# EAGLE design fmc-hpc-generic (EAGLE 8.3.2)
DESIGNER: JON NEWMAN; DESIGN_NAME: FMC HPC GENERIC; LICENSE: CC BY-NC-SA 4.0; REVISION: 1.0
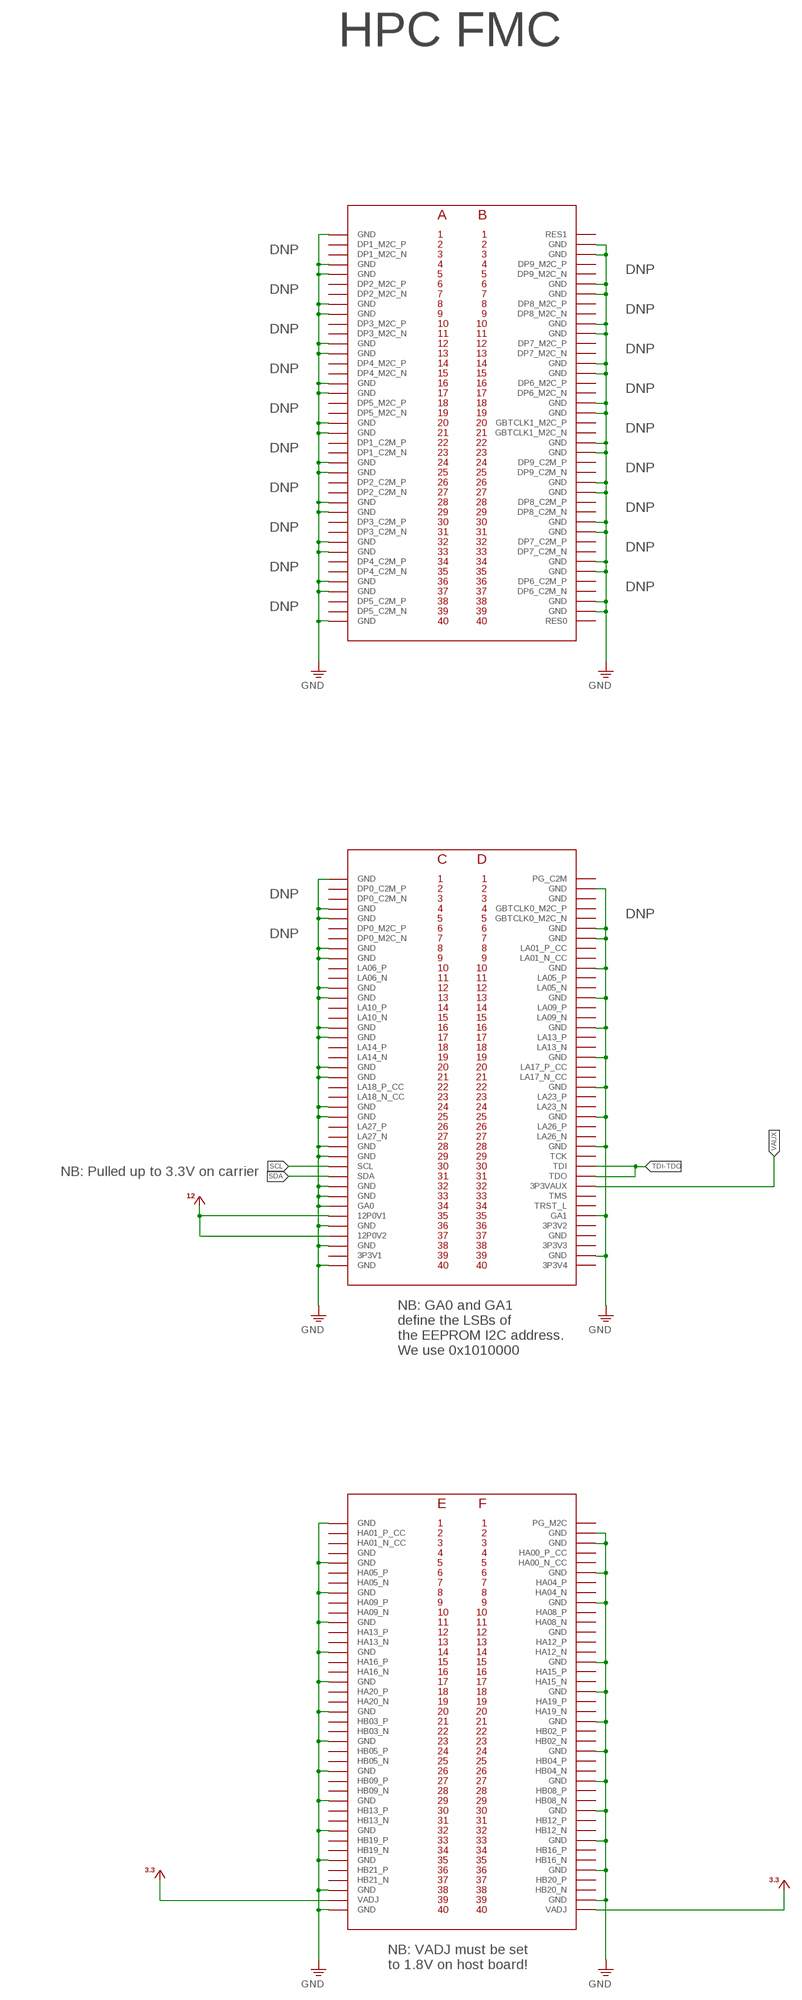
[diagram p0: schematic, sheet 1, part 1 of 3]
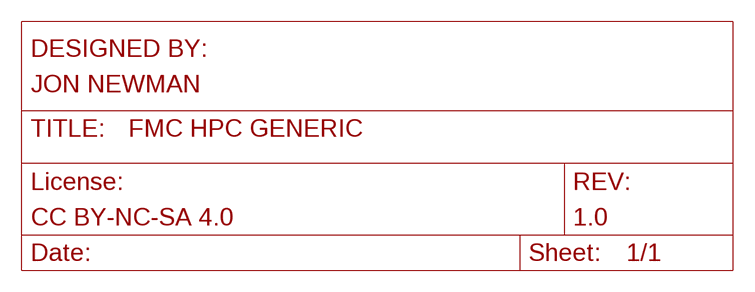
[diagram p1: schematic, sheet 1, part 2 of 3]
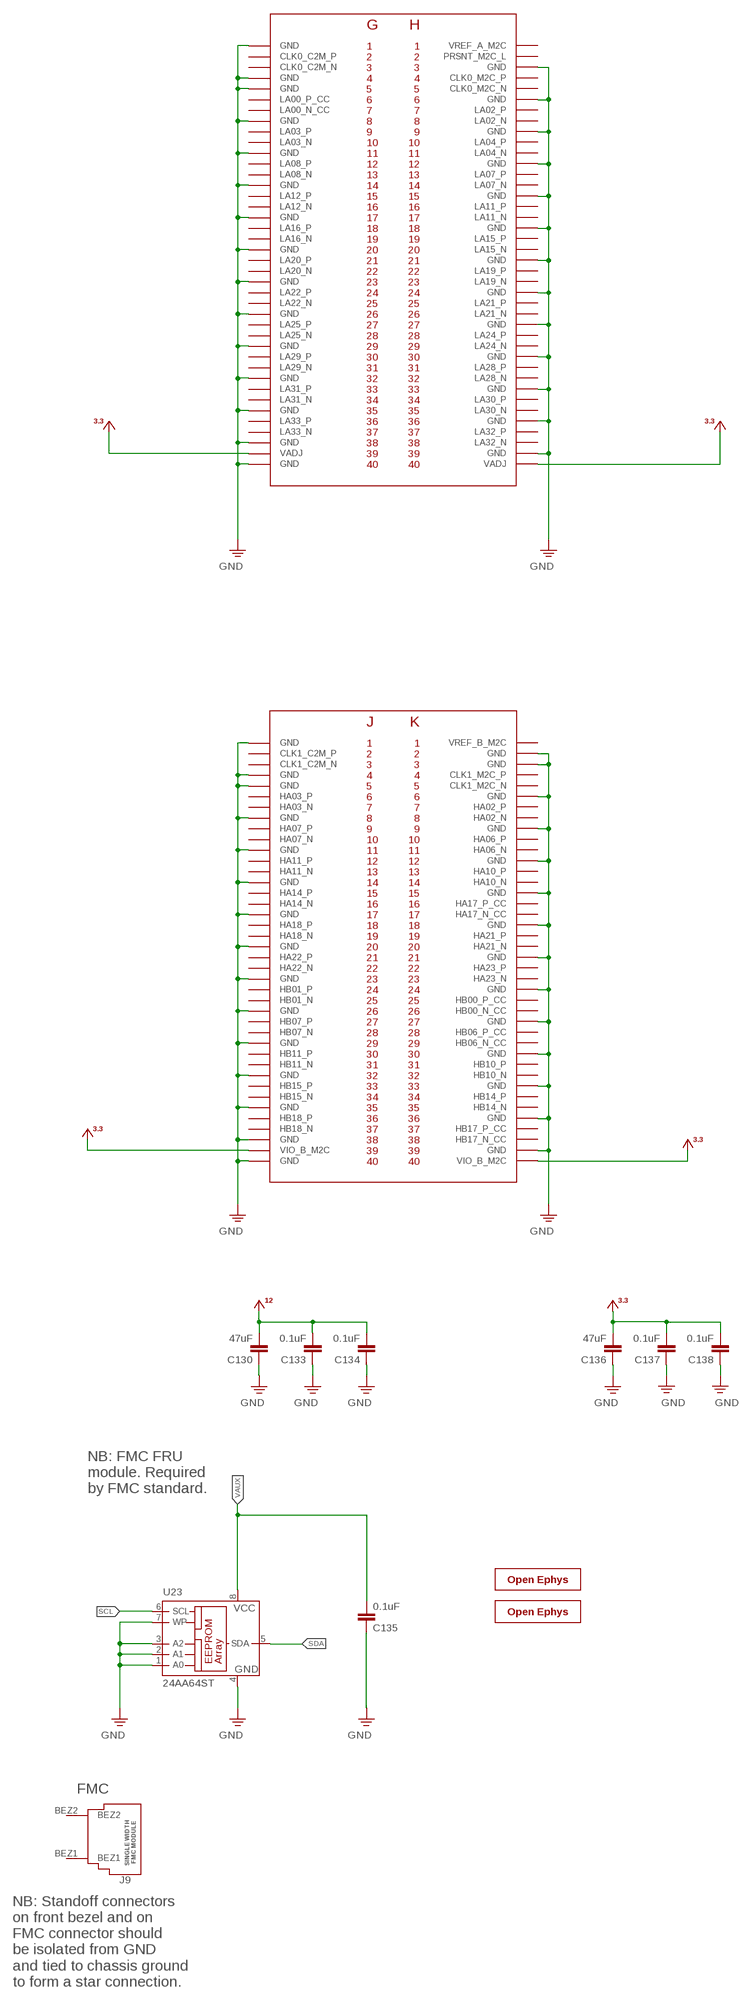
[diagram p2: schematic, sheet 1, part 3 of 3]

## Parts
C130  47uF  C_1210  [1210]
C133  0.1uF  C_0402  [0402]
C134  0.1uF  C_0402  [0402]
C135  0.1uF  C_0402  [0402]
C136  47uF  C_1210  [1210]
C137  0.1uF  C_0402  [0402]
C138  0.1uF  C_0402  [0402]
J9  FMC_SINGLE_WIDTH_MODULE  [FMC_SINGLE_WIDTH_MODULE]
J10  ASP-134488-01  FMC_HPC_400_PIN_MALE  [FMC_HPC_MALE]
U23  24AA64ST  [TSSOP8]
X2  OE-LOGO_7X5  [OE-LOGO-7X5]
X3  OE-LOGO_7X5  [OE-LOGO-7X5]

## Nets
+3V3: C136.2 C137.2 C138.2 J10.E39(VADJ) J10.F40(VADJ) J10.G39(VADJ) J10.H40(VADJ) J10.J39(VIO_B_M2C) J10.K40(VIO_B_M2C)
+12V: C130.2 C133.2 C134.2 J10.C35(12P0V1) J10.C37(12P0V2)
GND: C130.1 C133.1 C134.1 C135.1 C136.1 C137.1 C138.1 J10.A1(GND) J10.A4(GND) J10.A5(GND) J10.A8(GND) J10.A9(GND) J10.A12(GND) J10.A13(GND) J10.A16(GND) J10.A17(GND) J10.A20(GND) J10.A21(GND) J10.A24(GND) J10.A25(GND) J10.A28(GND) J10.A29(GND) J10.A32(GND) J10.A33(GND) J10.A36(GND) J10.A37(GND) J10.A40(GND) J10.B2(GND) J10.B3(GND) J10.B6(GND) J10.B7(GND) J10.B10(GND) J10.B11(GND) J10.B14(GND) J10.B15(GND) J10.B18(GND) J10.B19(GND) J10.B22(GND) J10.B23(GND) J10.B26(GND) J10.B27(GND) J10.B30(GND) J10.B31(GND) J10.B34(GND) J10.B35(GND) J10.B38(GND) J10.B39(GND) J10.C1(GND) J10.C4(GND) J10.C5(GND) J10.C8(GND) J10.C9(GND) J10.C12(GND) J10.C13(GND) J10.C16(GND) J10.C17(GND) J10.C20(GND) J10.C21(GND) J10.C24(GND) J10.C25(GND) J10.C28(GND) J10.C29(GND) J10.C32(GND) J10.C33(GND) J10.C34(GA0) J10.C36(GND) J10.C38(GND) J10.C40(GND) J10.D2(GND) J10.D6(GND) J10.D7(GND) J10.D10(GND) J10.D13(GND) J10.D16(GND) J10.D19(GND) J10.D22(GND) J10.D25(GND) J10.D28(GND) J10.D35(GA1) J10.D39(GND) J10.E1(GND) J10.E5(GND) J10.E8(GND) J10.E11(GND) J10.E14(GND) J10.E17(GND) J10.E20(GND) J10.E23(GND) J10.E26(GND) J10.E29(GND) J10.E32(GND) J10.E35(GND) J10.E38(GND) J10.E40(GND) J10.F2(GND) J10.F3(GND) J10.F6(GND) J10.F9(GND) J10.F15(GND) J10.F18(GND) J10.F21(GND) J10.F24(GND) J10.F27(GND) J10.F30(GND) J10.F33(GND) J10.F36(GND) J10.F39(GND) J10.G1(GND) J10.G4(GND) J10.G5(GND) J10.G8(GND) J10.G11(GND) J10.G14(GND) J10.G17(GND) J10.G20(GND) J10.G23(GND) J10.G26(GND) J10.G29(GND) J10.G32(GND) J10.G35(GND) J10.G38(GND) J10.G40(GND) J10.H3(GND) J10.H6(GND) J10.H9(GND) J10.H12(GND) J10.H15(GND) J10.H18(GND) J10.H21(GND) J10.H24(GND) J10.H27(GND) J10.H30(GND) J10.H33(GND) J10.H36(GND) J10.H39(GND) J10.J1(GND) J10.J4(GND) J10.J5(GND) J10.J8(GND) J10.J11(GND) J10.J14(GND) J10.J17(GND) J10.J20(GND) J10.J23(GND) J10.J26(GND) J10.J29(GND) J10.J32(GND) J10.J35(GND) J10.J38(GND) J10.J40(GND) J10.K2(GND) J10.K3(GND) J10.K6(GND) J10.K9(GND) J10.K12(GND) J10.K15(GND) J10.K18(GND) J10.K21(GND) J10.K24(GND) J10.K27(GND) J10.K30(GND) J10.K33(GND) J10.K36(GND) J10.K39(GND) U23.1(A0) U23.2(A1) U23.3(A2) U23.4(GND) U23.7(WP)
SCL: J10.C30(SCL) U23.6(SCL)
SDA: J10.C31(SDA) U23.5(SDA)
TDI-TDO: J10.D30(TDI) J10.D31(TDO)
VAUX: C135.2 J10.D32(3P3VAUX) U23.8(VCC)
Unconnected: J9.BEZ1 J9.BEZ2 J10.A2(DP1_M2C_P) J10.A3(DP1_M2C_N) J10.A6(DP2_M2C_P) J10.A7(DP2_M2C_N) J10.A10(DP3_M2C_P) J10.A11(DP3_M2C_N) J10.A14(DP4_M2C_P) J10.A15(DP4_M2C_N) J10.A18(DP5_M2C_P) J10.A19(DP5_M2C_N) J10.A22(DP1_C2M_P) J10.A23(DP1_C2M_N) J10.A26(DP2_C2M_P) J10.A27(DP2_C2M_N) J10.A30(DP3_C2M_P) J10.A31(DP3_C2M_N) J10.A34(DP4_C2M_P) J10.A35(DP4_C2M_N) J10.A38(DP5_C2M_P) J10.A39(DP5_C2M_N) J10.B1(RES1) J10.B4(DP9_M2C_P) J10.B5(DP9_M2C_N) J10.B8(DP8_M2C_P) J10.B9(DP8_M2C_N) J10.B12(DP7_M2C_P) J10.B13(DP7_M2C_N) J10.B16(DP6_M2C_P) J10.B17(DP6_M2C_N) J10.B20(GBTCLK1_M2C_P) J10.B21(GBTCLK1_M2C_N) J10.B24(DP9_C2M_P) J10.B25(DP9_C2M_N) J10.B28(DP8_C2M_P) J10.B29(DP8_C2M_N) J10.B32(DP7_C2M_P) J10.B33(DP7_C2M_N) J10.B36(DP6_C2M_P) J10.B37(DP6_C2M_N) J10.B40(RES0) J10.C2(DP0_C2M_P) J10.C3(DP0_C2M_N) J10.C6(DP0_M2C_P) J10.C7(DP0_M2C_N) J10.C10(LA06_P) J10.C11(LA06_N) J10.C14(LA10_P) J10.C15(LA10_N) J10.C18(LA14_P) J10.C19(LA14_N) J10.C22(LA18_P_CC) J10.C23(LA18_N_CC) J10.C26(LA27_P) J10.C27(LA27_N) J10.C39(3P3V1) J10.D1(PG_C2M) J10.D4(GBTCLK0_M2C_P) J10.D5(GBTCLK0_M2C_N) J10.D8(LA01_P_CC) J10.D9(LA01_N_CC) J10.D11(LA05_P) J10.D12(LA05_N) J10.D14(LA09_P) J10.D15(LA09_N) J10.D17(LA13_P) J10.D18(LA13_N) J10.D20(LA17_P_CC) J10.D21(LA17_N_CC) J10.D23(LA23_P) J10.D24(LA23_N) J10.D26(LA26_P) J10.D27(LA26_N) J10.D29(TCK) J10.D33(TMS) J10.D34(TRST_L) J10.D36(3P3V2) J10.D38(3P3V3) J10.D40(3P3V4) J10.E2(HA01_P_CC) J10.E3(HA01_N_CC) J10.E6(HA05_P) J10.E7(HA05_N) J10.E9(HA09_P) J10.E10(HA09_N) J10.E12(HA13_P) J10.E13(HA13_N) J10.E15(HA16_P) J10.E16(HA16_N) J10.E18(HA20_P) J10.E19(HA20_N) J10.E21(HB03_P) J10.E22(HB03_N) J10.E24(HB05_P) J10.E25(HB05_N) J10.E27(HB09_P) J10.E28(HB09_N) J10.E30(HB13_P) J10.E31(HB13_N) J10.E33(HB19_P) J10.E34(HB19_N) J10.E36(HB21_P) J10.E37(HB21_N) J10.F1(PG_M2C) J10.F4(HA00_P_CC) J10.F5(HA00_N_CC) J10.F7(HA04_P) J10.F8(HA04_N) J10.F10(HA08_P) J10.F11(HA08_N) J10.F13(HA12_P) J10.F14(HA12_N) J10.F16(HA15_P) J10.F17(HA15_N) J10.F19(HA19_P) J10.F20(HA19_N) J10.F22(HB02_P) J10.F23(HB02_N) J10.F25(HB04_P) J10.F26(HB04_N) J10.F28(HB08_P) J10.F29(HB08_N) J10.F31(HB12_P) J10.F32(HB12_N) J10.F34(HB16_P) J10.F35(HB16_N) J10.F37(HB20_P) J10.F38(HB20_N) J10.G2(CLK0_C2M_P) J10.G3(CLK0_C2M_N) J10.G6(LA00_P_CC) J10.G7(LA00_N_CC) J10.G9(LA03_P) J10.G10(LA03_N) J10.G12(LA08_P) J10.G13(LA08_N) J10.G15(LA12_P) J10.G16(LA12_N) J10.G18(LA16_P) J10.G19(LA16_N) J10.G21(LA20_P) J10.G22(LA20_N) J10.G24(LA22_P) J10.G25(LA22_N) J10.G27(LA25_P) J10.G28(LA25_N) J10.G30(LA29_P) J10.G31(LA29_N) J10.G33(LA31_P) J10.G34(LA31_N) J10.G36(LA33_P) J10.G37(LA33_N) J10.H1(VREF_A_M2C) J10.H2(PRSNT_M2C_L) J10.H4(CLK0_M2C_P) J10.H5(CLK0_M2C_N) J10.H7(LA02_P) J10.H8(LA02_N) J10.H10(LA04_P) J10.H11(LA04_N) J10.H13(LA07_P) J10.H14(LA07_N) J10.H16(LA11_P) J10.H17(LA11_N) J10.H19(LA15_P) J10.H20(LA15_N) J10.H22(LA19_P) J10.H23(LA19_N) J10.H25(LA21_P) J10.H26(LA21_N) J10.H28(LA24_P) J10.H29(LA24_N) J10.H31(LA28_P) J10.H32(LA28_N) J10.H34(LA30_P) J10.H35(LA30_N) J10.H37(LA32_P) J10.H38(LA32_N) J10.J2(CLK1_C2M_P) J10.J3(CLK1_C2M_N) J10.J6(HA03_P) J10.J7(HA03_N) J10.J9(HA07_P) J10.J10(HA07_N) J10.J12(HA11_P) J10.J13(HA11_N) J10.J15(HA14_P) J10.J16(HA14_N) J10.J18(HA18_P) J10.J19(HA18_N) J10.J21(HA22_P) J10.J22(HA22_N) J10.J24(HB01_P) J10.J25(HB01_N) J10.J27(HB07_P) J10.J28(HB07_N) J10.J30(HB11_P) J10.J31(HB11_N) J10.J33(HB15_P) J10.J34(HB15_N) J10.J36(HB18_P) J10.J37(HB18_N) J10.K1(VREF_B_M2C) J10.K4(CLK1_M2C_P) J10.K5(CLK1_M2C_N) J10.K7(HA02_P) J10.K8(HA02_N) J10.K10(HA06_P) J10.K11(HA06_N) J10.K13(HA10_P) J10.K14(HA10_N) J10.K16(HA17_P_CC) J10.K17(HA17_N_CC) J10.K19(HA21_P) J10.K20(HA21_N) J10.K22(HA23_P) J10.K23(HA23_N) J10.K25(HB00_P_CC) J10.K26(HB00_N_CC) J10.K28(HB06_P_CC) J10.K29(HB06_N_CC) J10.K31(HB10_P) J10.K32(HB10_N) J10.K34(HB14_P) J10.K35(HB14_N) J10.K37(HB17_P_CC) J10.K38(HB17_N_CC)

## Notes on the sheet
- HPC FMC
- DNP
- DNP
- DNP
- DNP
- DNP
- DNP
- DNP
- DNP
- DNP
- DNP
- DNP
- DNP
- DNP
- DNP
- DNP
- DNP
- DNP
- DNP
- DNP
- DNP
- DNP
- DNP
- NB: Pulled up to 3.3V on carrier
- NB: GA0 and GA1 
  define the LSBs of 
  the EEPROM I2C address.
  We use 0x1010000
- NB: VADJ must be set
  to 1.8V on host board!
- NB: FMC FRU 
  module. Required 
  by FMC standard.
- FMC
- NB: Standoff connectors
  on front bezel and on 
  FMC connector should
  be isolated from GND
  and tied to chassis ground
  to form a star connection.

## Power pins joined to a net without a drawn wire
GND: J10.D3(GND) J10.D37(GND) J10.E4(GND) J10.F12(GND)

## Library data of the parts
C130 C133-C138 = jonnew:C: Capacitor
J9 = jonnew:FMC_SINGLE_WIDTH_MODULE
J10 = jonnew:FMC_HPC_400_PIN
U23 = jonnew:24*: Serial EEPROM I2C; MPN: 25AA640A-I/ST; OC_FARNELL: 1818513; OC_NEWARK: 27M1300
X2 X3 = jonnew:OE-LOGO

## Net classes
1 130 Ohm Diff Top: width 0.09 mm, drill 0.2 mm, clearance 0.089 mm
2 50 Ohm Single Top: width 0.15 mm, drill 0.2 mm
3 100 Ohm Diff Mid: width 0.19 mm, drill 0.2 mm, clearance 0.09 mm
4 50 Ohm Single Mid: width 0.2 mm, drill 0.2 mm
5 100 Ohm Diff Top: width 0.15 mm, drill 0.2 mm, clearance 0.09 mm
6 Link: width 0.15 mm, drill 0.2 mm, clearance 0.5 mm
7 CAN 210 Diff Top: width 0.11 mm, drill 0.2 mm, clearance 0.09 mm

## Board
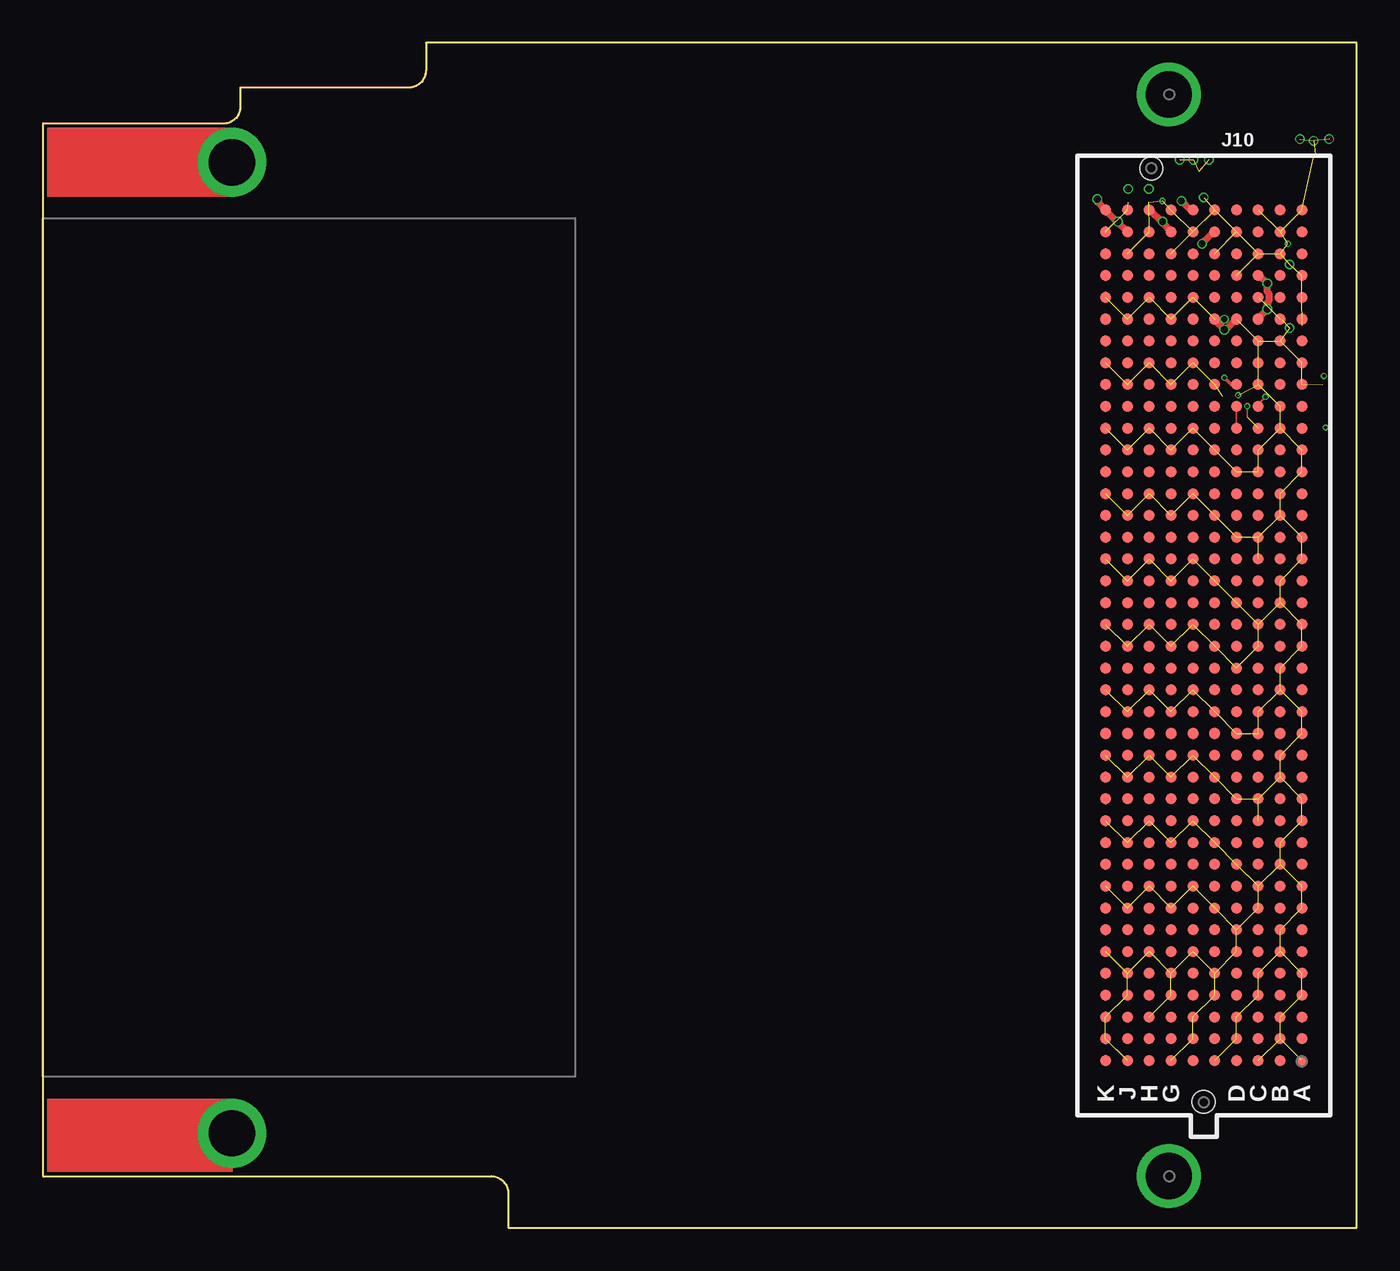
[diagram p3: board, top side]
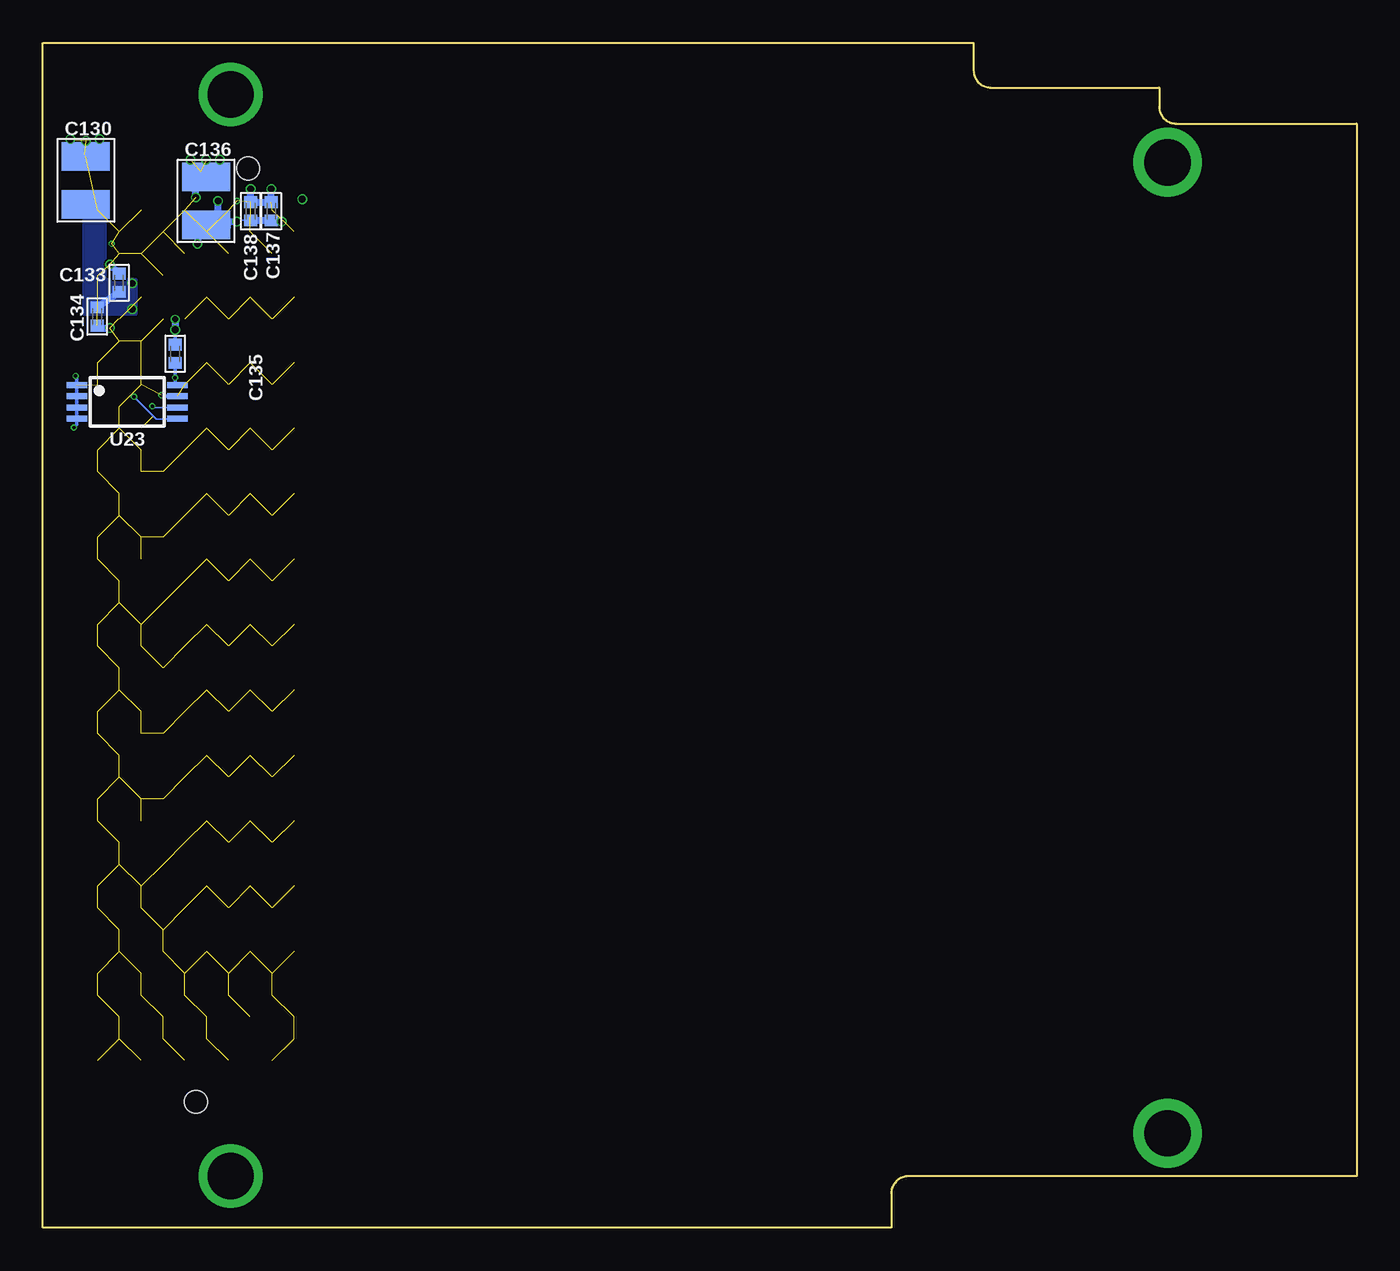
[diagram p4: board, bottom side, seen from below]

Size 76.5 x 69 mm. Coordinates in mm from the lower left corner, seen from the top.
Copper layers (1+2*3+4*5+16): Top/HighSpeed 0.035mm / dielectric 0.1mm / GND1 0.0175mm / dielectric 0.565mm / Highspeed2 0.0175mm / dielectric 5mil / GND3 0.0175mm / dielectric 0.565mm / VCC 0.0175mm / dielectric 0.1mm / Bottom/LowSpeed 0.035mm
Design rules "jlcpcb-6-layer *": minimum track width 3.5mil, minimum drill 0.2mm, track to track 3.5mil, track to pad 3.5mil, pad to pad 3.5mil, via to via 5mil, smd to smd 0mil, copper to edge 0.2mm, drill to drill 5mil, minimum pad ring 3mil, minimum via ring 3mil, stop-mask expansion 0mil, vias tented up to drill 100mil, thermal gap 0.12mm
tRestrict: area 63.6,1 to 67.6,5; area 63.6,64 to 67.6,68

### Footprints (pad centres in the part's own frame; a part is rotated, then mirrored left to right if it is on the bottom)
1210 = smd 1.651 x 2.794: 1 -1.397,0; 2 1.397,0
0402 = smd 0.686 x 0.762: 1 -0.533,0; 2 0.533,0
FMC_SINGLE_WIDTH_MODULE = drill 2.7 pad 4: BEZ1 -54.6,59.05; BEZ2 -54.6,2.5
FMC_HPC_MALE = smd 0.635 x 0.635: A1 24.765,5.715; A2 23.495,5.715; A3 22.225,5.715; A4 20.955,5.715; A5 19.685,5.715; A6 18.415,5.715; A7 17.145,5.715; A8 15.875,5.715; A9 14.605,5.715; A10 13.335,5.715; A11 12.065,5.715; A12 10.795,5.715; A13 9.525,5.715; A14 8.255,5.715; A15 6.985,5.715; A16 5.715,5.715; A17 4.445,5.715; A18 3.175,5.715; A19 1.905,5.715; A20 0.635,5.715; A21 -0.635,5.715; A22 -1.905,5.715; A23 -3.175,5.715; A24 -4.445,5.715; A25 -5.715,5.715; A26 -6.985,5.715; A27 -8.255,5.715; A28 -9.525,5.715; A29 -10.795,5.715; A30 -12.065,5.715; A31 -13.335,5.715; A32 -14.605,5.715; A33 -15.875,5.715; A34 -17.145,5.715; A35 -18.415,5.715; A36 -19.685,5.715; A37 -20.955,5.715; A38 -22.225,5.715; A39 -23.495,5.715; A40 -24.765,5.715; B1 24.765,4.445; B2 23.495,4.445; B3 22.225,4.445; B4 20.955,4.445; B5 19.685,4.445; B6 18.415,4.445; B7 17.145,4.445; B8 15.875,4.445; B9 14.605,4.445; B10 13.335,4.445; B11 12.065,4.445; B12 10.795,4.445; B13 9.525,4.445; B14 8.255,4.445; B15 6.985,4.445; B16 5.715,4.445; B17 4.445,4.445; B18 3.175,4.445; B19 1.905,4.445; B20 0.635,4.445; B21 -0.635,4.445; B22 -1.905,4.445; B23 -3.175,4.445; B24 -4.445,4.445; B25 -5.715,4.445; B26 -6.985,4.445; B27 -8.255,4.445; B28 -9.525,4.445; B29 -10.795,4.445; B30 -12.065,4.445; B31 -13.335,4.445; B32 -14.605,4.445; B33 -15.875,4.445; B34 -17.145,4.445; B35 -18.415,4.445; B36 -19.685,4.445; B37 -20.955,4.445; B38 -22.225,4.445; B39 -23.495,4.445; B40 -24.765,4.445; C1 24.765,3.175; C2 23.495,3.175; C3 22.225,3.175; C4 20.955,3.175; C5 19.685,3.175; C6 18.415,3.175; C7 17.145,3.175; C8 15.875,3.175; C9 14.605,3.175; C10 13.335,3.175; C11 12.065,3.175; C12 10.795,3.175; C13 9.525,3.175; C14 8.255,3.175; C15 6.985,3.175; C16 5.715,3.175; C17 4.445,3.175; C18 3.175,3.175; C19 1.905,3.175; C20 0.635,3.175; C21 -0.635,3.175; C22 -1.905,3.175; C23 -3.175,3.175; C24 -4.445,3.175; C25 -5.715,3.175; C26 -6.985,3.175; C27 -8.255,3.175; C28 -9.525,3.175; C29 -10.795,3.175; C30 -12.065,3.175; C31 -13.335,3.175; C32 -14.605,3.175; C33 -15.875,3.175; C34 -17.145,3.175; C35 -18.415,3.175; C36 -19.685,3.175; C37 -20.955,3.175; C38 -22.225,3.175; C39 -23.495,3.175; C40 -24.765,3.175; D1 24.765,1.905; D2 23.495,1.905; D3 22.225,1.905; D4 20.955,1.905; D5 19.685,1.905; D6 18.415,1.905; D7 17.145,1.905; D8 15.875,1.905; D9 14.605,1.905; D10 13.335,1.905; D11 12.065,1.905; D12 10.795,1.905; D13 9.525,1.905; D14 8.255,1.905; D15 6.985,1.905; D16 5.715,1.905; D17 4.445,1.905; D18 3.175,1.905; D19 1.905,1.905; D20 0.635,1.905; D21 -0.635,1.905; D22 -1.905,1.905; D23 -3.175,1.905; D24 -4.445,1.905; D25 -5.715,1.905; D26 -6.985,1.905; D27 -8.255,1.905; D28 -9.525,1.905; D29 -10.795,1.905; D30 -12.065,1.905; D31 -13.335,1.905; D32 -14.605,1.905; D33 -15.875,1.905; D34 -17.145,1.905; D35 -18.415,1.905; D36 -19.685,1.905; D37 -20.955,1.905; D38 -22.225,1.905; D39 -23.495,1.905; D40 -24.765,1.905; E1 24.765,0.635; E2 23.495,0.635; E3 22.225,0.635; E4 20.955,0.635; E5 19.685,0.635; E6 18.415,0.635; E7 17.145,0.635; E8 15.875,0.635; E9 14.605,0.635; E10 13.335,0.635; E11 12.065,0.635; E12 10.795,0.635; E13 9.525,0.635; E14 8.255,0.635; E15 6.985,0.635; E16 5.715,0.635; E17 4.445,0.635; E18 3.175,0.635; E19 1.905,0.635; E20 0.635,0.635; E21 -0.635,0.635; E22 -1.905,0.635; E23 -3.175,0.635; E24 -4.445,0.635; E25 -5.715,0.635; E26 -6.985,0.635; E27 -8.255,0.635; E28 -9.525,0.635; E29 -10.795,0.635; E30 -12.065,0.635; E31 -13.335,0.635; E32 -14.605,0.635; E33 -15.875,0.635; E34 -17.145,0.635; E35 -18.415,0.635; E36 -19.685,0.635; E37 -20.955,0.635; E38 -22.225,0.635; E39 -23.495,0.635; E40 -24.765,0.635; F1 24.765,-0.635; F2 23.495,-0.635; F3 22.225,-0.635; F4 20.955,-0.635; F5 19.685,-0.635; F6 18.415,-0.635; F7 17.145,-0.635; F8 15.875,-0.635; F9 14.605,-0.635; F10 13.335,-0.635; F11 12.065,-0.635; F12 10.795,-0.635; F13 9.525,-0.635; F14 8.255,-0.635; F15 6.985,-0.635; F16 5.715,-0.635; F17 4.445,-0.635; F18 3.175,-0.635; F19 1.905,-0.635; F20 0.635,-0.635; F21 -0.635,-0.635; F22 -1.905,-0.635; F23 -3.175,-0.635; F24 -4.445,-0.635; F25 -5.715,-0.635; F26 -6.985,-0.635; F27 -8.255,-0.635; F28 -9.525,-0.635; F29 -10.795,-0.635; F30 -12.065,-0.635; F31 -13.335,-0.635; F32 -14.605,-0.635; F33 -15.875,-0.635; F34 -17.145,-0.635; F35 -18.415,-0.635; F36 -19.685,-0.635; F37 -20.955,-0.635; F38 -22.225,-0.635; F39 -23.495,-0.635; F40 -24.765,-0.635; G1 24.765,-1.905; G2 23.495,-1.905; G3 22.225,-1.905; G4 20.955,-1.905; G5 19.685,-1.905; G6 18.415,-1.905; G7 17.145,-1.905; G8 15.875,-1.905; G9 14.605,-1.905; G10 13.335,-1.905; G11 12.065,-1.905; G12 10.795,-1.905; G13 9.525,-1.905; G14 8.255,-1.905; G15 6.985,-1.905; G16 5.715,-1.905; G17 4.445,-1.905; G18 3.175,-1.905; G19 1.905,-1.905; G20 0.635,-1.905; G21 -0.635,-1.905; G22 -1.905,-1.905; G23 -3.175,-1.905; G24 -4.445,-1.905; G25 -5.715,-1.905; G26 -6.985,-1.905; G27 -8.255,-1.905; G28 -9.525,-1.905; G29 -10.795,-1.905; G30 -12.065,-1.905; G31 -13.335,-1.905; G32 -14.605,-1.905; G33 -15.875,-1.905; G34 -17.145,-1.905; G35 -18.415,-1.905; G36 -19.685,-1.905; G37 -20.955,-1.905; G38 -22.225,-1.905; G39 -23.495,-1.905; G40 -24.765,-1.905; H1 24.765,-3.175; H2 23.495,-3.175; H3 22.225,-3.175; H4 20.955,-3.175; H5 19.685,-3.175; H6 18.415,-3.175; H7 17.145,-3.175; H8 15.875,-3.175; H9 14.605,-3.175; H10 13.335,-3.175; H11 12.065,-3.175; H12 10.795,-3.175; H13 9.525,-3.175; H14 8.255,-3.175; H15 6.985,-3.175; H16 5.715,-3.175; H17 4.445,-3.175; H18 3.175,-3.175; H19 1.905,-3.175; H20 0.635,-3.175; H21 -0.635,-3.175; H22 -1.905,-3.175; H23 -3.175,-3.175; H24 -4.445,-3.175; H25 -5.715,-3.175; H26 -6.985,-3.175; H27 -8.255,-3.175; H28 -9.525,-3.175; H29 -10.795,-3.175; H30 -12.065,-3.175; H31 -13.335,-3.175; H32 -14.605,-3.175; H33 -15.875,-3.175; H34 -17.145,-3.175; H35 -18.415,-3.175; H36 -19.685,-3.175; H37 -20.955,-3.175; H38 -22.225,-3.175; H39 -23.495,-3.175; H40 -24.765,-3.175; J1 24.765,-4.445; J2 23.495,-4.445; J3 22.225,-4.445; J4 20.955,-4.445; J5 19.685,-4.445; J6 18.415,-4.445; J7 17.145,-4.445; J8 15.875,-4.445; J9 14.605,-4.445; J10 13.335,-4.445; J11 12.065,-4.445; J12 10.795,-4.445; J13 9.525,-4.445; J14 8.255,-4.445; J15 6.985,-4.445; J16 5.715,-4.445; J17 4.445,-4.445; J18 3.175,-4.445; J19 1.905,-4.445; J20 0.635,-4.445; J21 -0.635,-4.445; J22 -1.905,-4.445; J23 -3.175,-4.445; J24 -4.445,-4.445; J25 -5.715,-4.445; J26 -6.985,-4.445; J27 -8.255,-4.445; J28 -9.525,-4.445; J29 -10.795,-4.445; J30 -12.065,-4.445; J31 -13.335,-4.445; J32 -14.605,-4.445; J33 -15.875,-4.445; J34 -17.145,-4.445; J35 -18.415,-4.445; J36 -19.685,-4.445; J37 -20.955,-4.445; J38 -22.225,-4.445; J39 -23.495,-4.445; J40 -24.765,-4.445; K1 24.765,-5.715; K2 23.495,-5.715; K3 22.225,-5.715; K4 20.955,-5.715; K5 19.685,-5.715; K6 18.415,-5.715; K7 17.145,-5.715; K8 15.875,-5.715; K9 14.605,-5.715; K10 13.335,-5.715; K11 12.065,-5.715; K12 10.795,-5.715; K13 9.525,-5.715; K14 8.255,-5.715; K15 6.985,-5.715; K16 5.715,-5.715; K17 4.445,-5.715; K18 3.175,-5.715; K19 1.905,-5.715; K20 0.635,-5.715; K21 -0.635,-5.715; K22 -1.905,-5.715; K23 -3.175,-5.715; K24 -4.445,-5.715; K25 -5.715,-5.715; K26 -6.985,-5.715; K27 -8.255,-5.715; K28 -9.525,-5.715; K29 -10.795,-5.715; K30 -12.065,-5.715; K31 -13.335,-5.715; K32 -14.605,-5.715; K33 -15.875,-5.715; K34 -17.145,-5.715; K35 -18.415,-5.715; K36 -19.685,-5.715; K37 -20.955,-5.715; K38 -22.225,-5.715; K39 -23.495,-5.715; K40 -24.765,-5.715 | drill 2.692: GNDA -31.496,-2.032; GNDB 31.496,-2.032 | hole 1.321: 27.165,0; -27.191,-3.05
TSSOP8 = smd 0.35 x 1.2: 1 -0.975,-2.925; 2 -0.325,-2.925; 3 0.325,-2.925; 4 0.975,-2.925; 5 0.975,2.925; 6 0.325,2.925; 7 -0.325,2.925; 8 -0.975,2.925

### Placement (x,y rotation side)
C130  74,61 270 bottom
C133  72.07,55.03 270 bottom
C134  73.33,53.07 90 bottom
C135  68.8,50.9 270 bottom
C136  67,59.8 270 bottom
C137  63.2,59.2 270 bottom
C138  64.4,59.2 270 bottom
J9  65.6,3 0 top
J10  67.6,34.5 270 top
U23  71.6,48.1 270 bottom
X2  114,3.5 0 top  (outside the outline)
X3  124.1,3.5 0 bottom  (outside the outline)

### Tracks (layer width: path | path; a pad name or v marks a point on that pad's centre or on a via)
+3V3  (via drill 0.4)
  Top/HighSpeed 0.4: J10.F40 66.83,59.27 v66.3,59.8 | J10.G39 v65.2,58.6 J10.H40 | v61.4,59.9 61.4,59.75 J10.K40 62.55,58.6 | 62.55,58.6 v62.6,58.6 | J10.J39 62.55,58.6 | v67.5,57.3 68.19,57.99 J10.E39
  Bottom/LowSpeed 0.09: C138.2 65.13,58.67 v65.2,58.6
  Bottom/LowSpeed 0.4: 67.5,58.4 v67.5,57.3 | 67.5,58.4 67.5,58.6 | 66.3,58.5 v66.3,59.8 | 66.3,58.5 66.3,58.35 | v65.2,58.6 66.3,58.5 | C136.2 67.5,58.4 | C138.2 C137.2 63.13,58.6 v62.6,58.6
  Bottom/LowSpeed 1.5: C136.2 66.95,58.35 66.3,58.35
+12V  (via drill 0.4)
  Top/HighSpeed 0.4: J10.C37 70.84,55.45 v71.3,55 71.3,54.52 71.38,54.44 71.38,53.93 71.3,53.85 v71.3,53.5 70.77,52.98 J10.C35
  Bottom/LowSpeed 0.4: C134.2 C133.2
  pour Bottom/LowSpeed (no thermals): 71.1,55.2 72.9,55.2 72.9,60.3 74.1,60.3 74.1,53.2 71.1,53.2
GND  (via drill 0.2, 0.35, 0.4)  (174 unrouted)
  Top/HighSpeed 0.4: J10.E35 68.23,52.87 v68.8,52.3 68.89,52.3 J10.D35 | 72.11,52.91 J10.B35
  Bottom/LowSpeed 0.2: v68.8,52.3 C135.1 | v74.6,49.6 74.52,49.52 U23.1 U23.2 U23.3 U23.4 74.52,46.77 v74.7,46.6 | U23.7 69.54,48.42 v69.6,48.48
  Bottom/LowSpeed 0.4: v68.8,52.9 v68.8,52.3 | C134.1 73.2,52.4 v72.6,52.4 | C133.1 v72.6,56.1 | 74.1,62.5 C130.1 | 67.6,61.1 67.1,61.1 C136.1 67.3,61.5 | v64.4,60.5 C138.1 C137.1 v63.2,60.5 | v67.6,60 67.6,61.1 | 68,60.7 67.6,61.1
  other vias: 67.9,62.2 72.5,57.3 65.2,59.8 67,62.2 73.2,63.4 74,63.3 74.9,63.4 66.2,62.2
SCL  (via drill 0.2)  (1 unrouted)
  Top/HighSpeed 0.09: 70.13,47.21 v70.13,47.84
  Bottom/LowSpeed 0.09: U23.6 70.06,47.77 v70.13,47.84
SDA  (via drill 0.2)
  Top/HighSpeed 0.09: v71.2,48.4 70.77,47.98 J10.C31
  Bottom/LowSpeed 0.09: 68.72,47.17 68.75,47.2 | 68.72,47.17 U23.5 | 68.72,47.17 68.8,47.1 69.9,47.1 v71.2,48.4
TDI-TDO
  Top/HighSpeed 0.09: J10.D30 J10.D31
VAUX  (via drill 0.2)
  Top/HighSpeed 0.2: v68.8,49.5 69.19,49.1 J10.D32
  Bottom/LowSpeed 0.09: C135.2 69.13,50.37
  Bottom/LowSpeed 0.2: U23.8 68.8,49.2 v68.8,49.5 C135.2

### Text on the board
bPlace: ABC Board | Rev. x.x / Designer / 2020
FMC_PIN_TYPE: FMC Pin Types / / A = GPIO, Bank A / B = GPIO, Bank B / / SA = Single clock domain capable AND FMC-spec clock, Bank A / SB = Single clock domain capable AND FMC-spec clock, Bank B / / MA = Multi clock domain capable AND FMC-spec clock, Bank A / MB = Multi clock domain capable AND FMC-spec clock, Bank B / / MS = Single clock domain capableA AND dedicated Mez to Carrier Clock / MC = Multi clock domain capableA AND dedicated Mez to Carrier Clock | SB | SC | A | B | SB | B | A | A | B | B | B | A | B | B | SA | B | B | B | SA | A | B | B | B | A | B | B | SA | B | B | B | SA | A | B | B | B | A | B | MB | A | B | MB | B | A | A | B | B | B | A | B | A | A | MB | A | B | A | A | MB | B | A | A | B | B | B | A | B | A | A | A | B | A | MA | A | A | A | A | B | B | MA | A | A | B | MA | A | A | MA | A | A | A | A | A | A | A | A | A | A | A | A | A | A | A | A | A | A | A | A | A | A | A | A | A | A | A | A | A | A | A | A | A | A | A | A | A | A | A | A | A | A | A | A | A | A | A | A | A | A | A | A | A | A | MA | A | A | A | MA | A | A | A | SA | A | A | A | SA | A | SC | MC | SA | SC | MC | SA | MC | SC | MA | MC | SC | MA | JLCPCB 6 layer stackup: / / 1. Top Copper 0.035 mm / P. Prepreg (2313*1) 0.1 mm / 2. Inner Copper 0.0175 mm / / C. Core (Copper) 0.565 mm / / 3. Inner Copper 0.0175 mm / P. Prepeg (2116*1) 0.127 mm / 4. Inner Copper 0.0175 mm / / C. Core (Copper) 0.565 mm / / 5. Inner Copper 0.0175 mm / P. Prepreg (2313*1) 0.1 mm / 6. Bottom Copper 0.0175 mm